# EasyEDA schematic Train_Barrierx7_OPTO.json
TITLE: Train Barrier controler x7 and opto; REV: o.0; Date: 2022-07-04; Sheet: 1/1; Drawn By: AmirB@mada.org.il; Company: Blomfield Science Museum
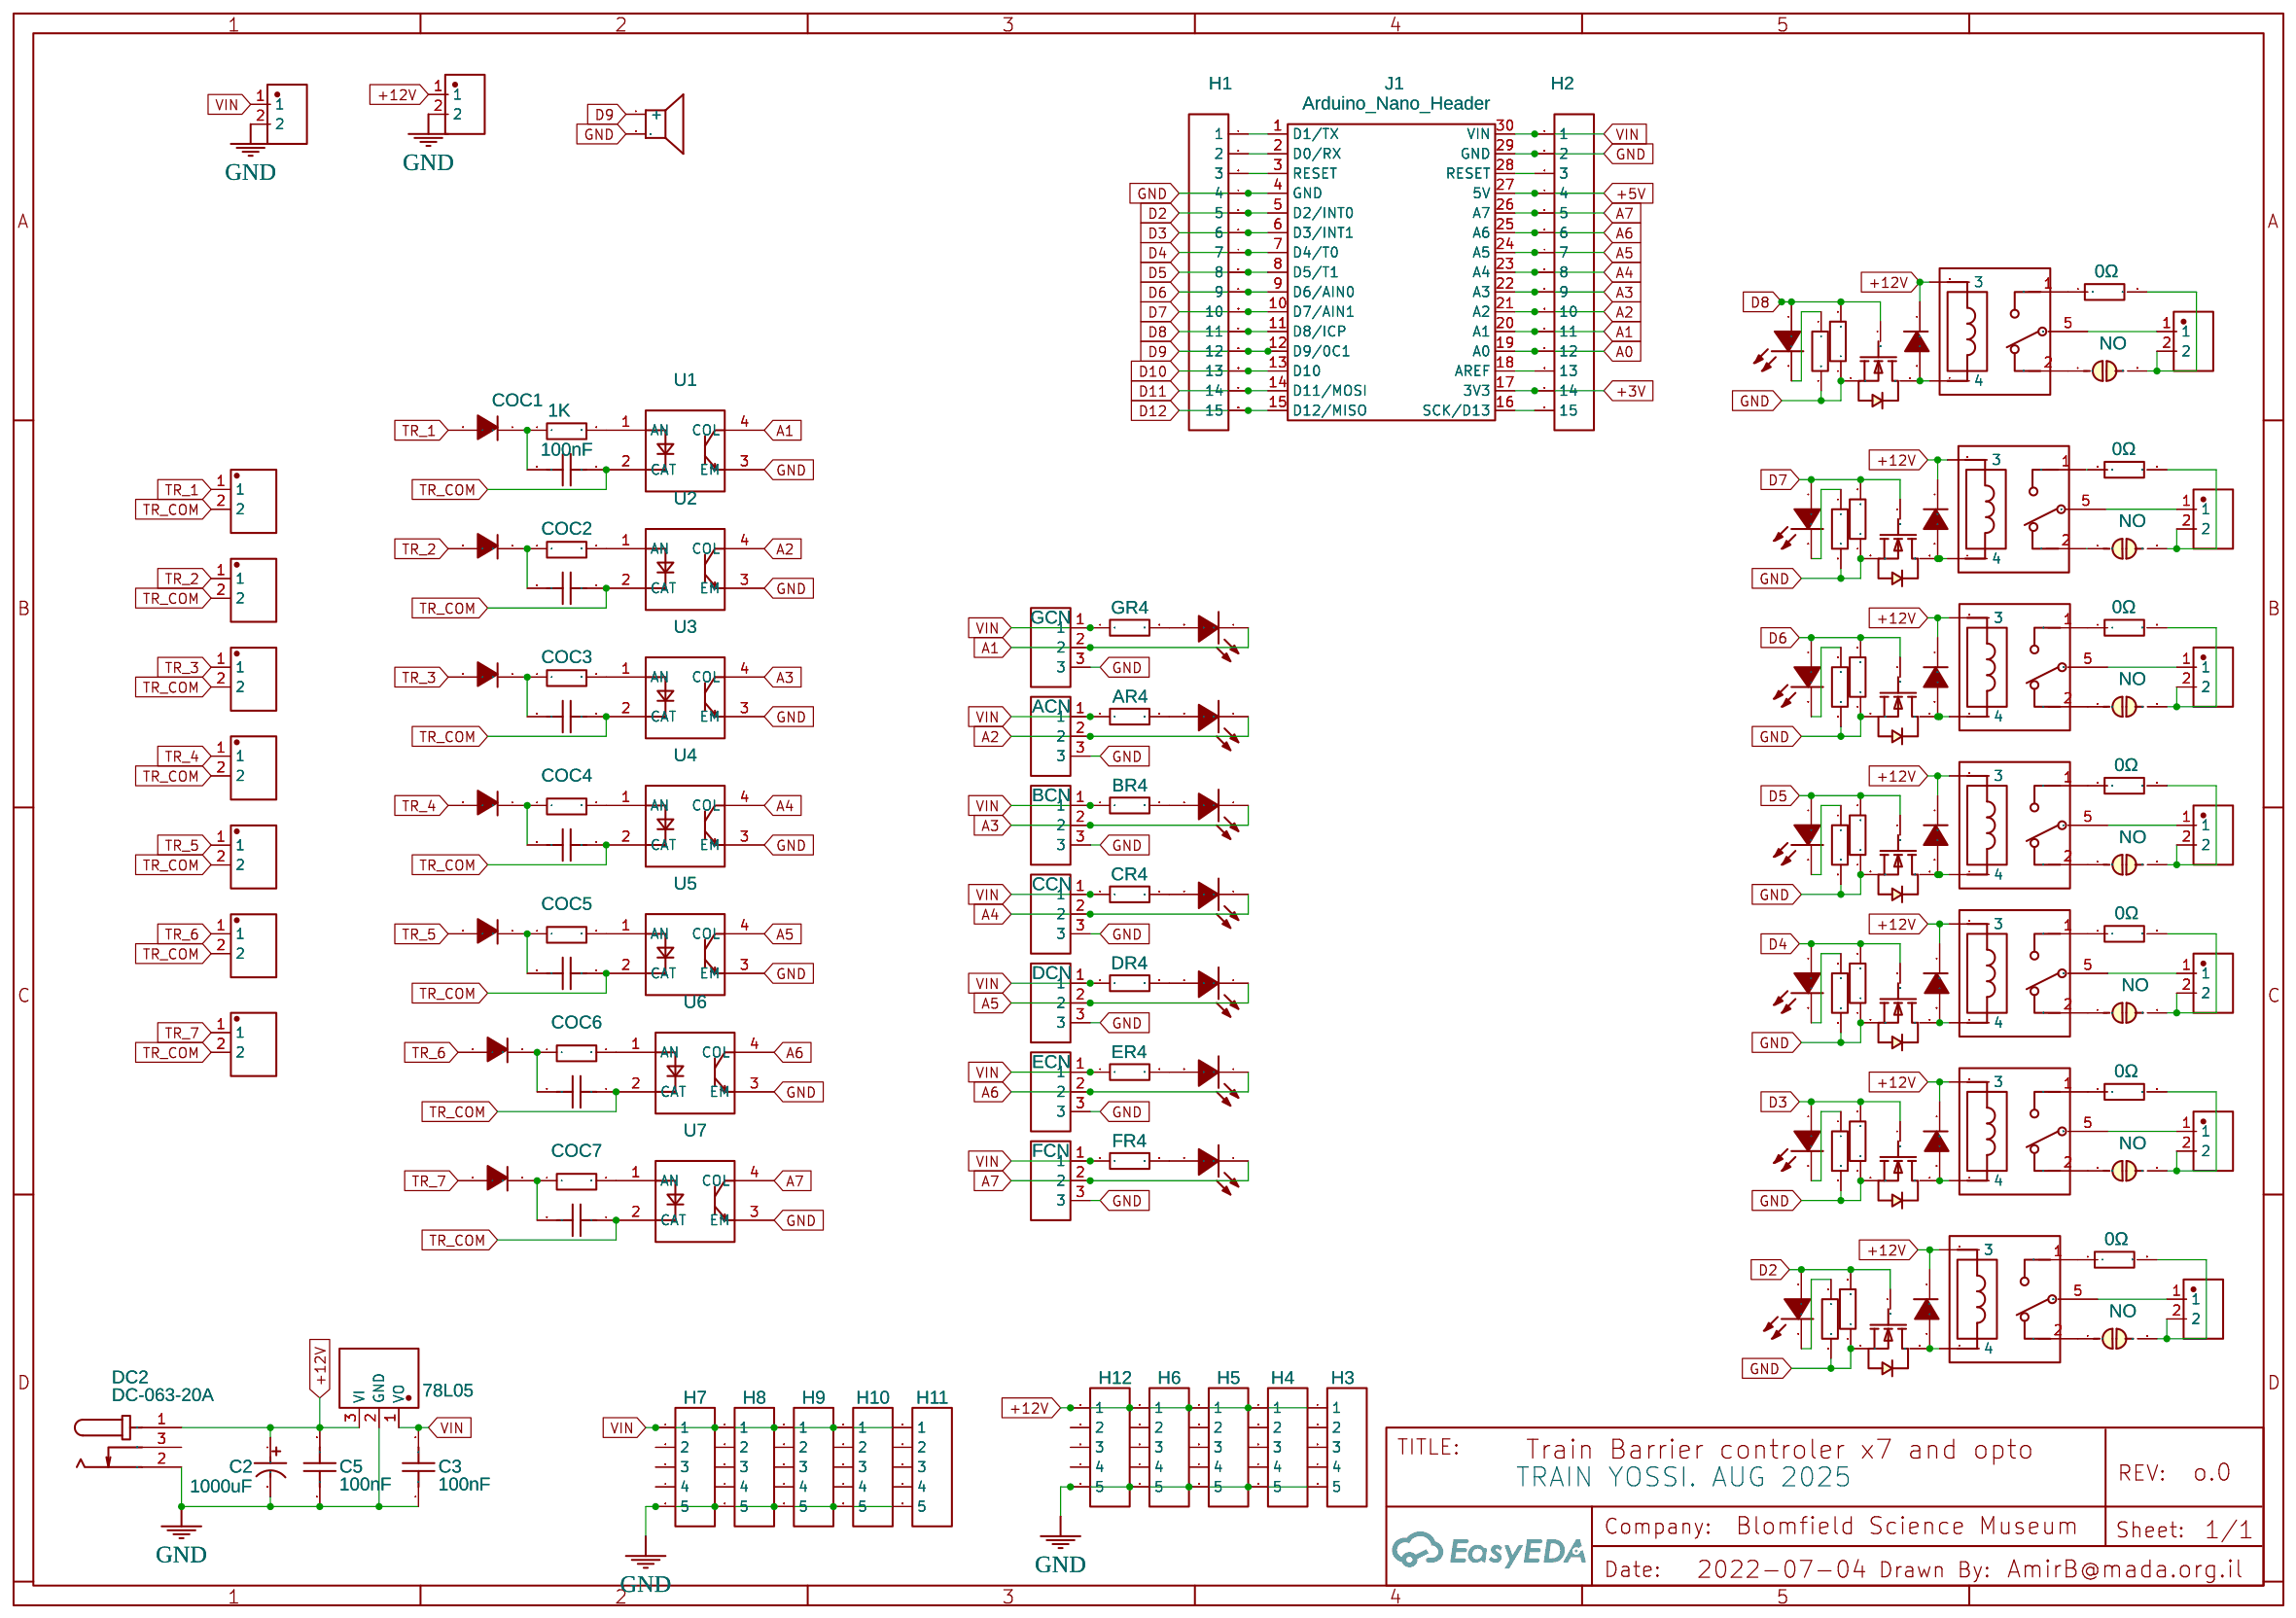
[diagram p0: schematic sheet]

## Parts
78L05  78L05_C842819  [SOT-89-3_L4.5-W2.5-P1.50-LS4.2-BR]
ACN  FK2510  [CONN-TH_3P-P2.00_KF2510_3A]
ACON1  KF2510-2A  [CONN-TH_KF2510-2A]
ACON2  KF2510-2A  [CONN-TH_KF2510-2A]
ACON3  KF2510-2A  [CONN-TH_KF2510-2A]
ACON4  KF2510-2A  [CONN-TH_KF2510-2A]
ACON5  KF2510-2A  [CONN-TH_KF2510-2A]
ACON6  KF2510-2A  [CONN-TH_KF2510-2A]
ACON7  KF2510-2A  [CONN-TH_KF2510-2A]
ACR  CR  [CONN-TH_P5.00_KF301-5.0-2P]
AD  SM4007PL  [SOD-123F_L2.8-W1.8-LS3.7-RD]
AJ  NO  [JUMPERS_SMT-JUMPER_2_NC_PASTE_NO-SILK]
AK  SRA-12VDC-CL  [RELAY-TH_SRA-X-CX]
AL  0603White light_C2290  [LED0603-R-RD_WHITE]
ALR  KT-0603R  [LED0603-RD]
AQ  AO3400A  [SOT-23-3_L2.9-W1.3-P1.90-LS2.4-BR]
AR1  1K  [R0603]
AR2  1K  [R0603]
AR3  0Ω  [R0402]
AR4  1kΩ  [R0603]
BCN  FK2510  [CONN-TH_3P-P2.00_KF2510_3A]
BCR  CR  [CONN-TH_P5.00_KF301-5.0-2P]
BD  SM4007PL  [SOD-123F_L2.8-W1.8-LS3.7-RD]
BJ  NO  [JUMPERS_SMT-JUMPER_2_NC_PASTE_NO-SILK]
BK  SRA-12VDC-CL  [RELAY-TH_SRA-X-CX]
BL  0603White light_C2290  [LED0603-R-RD_WHITE]
BLR  KT-0603R  [LED0603-RD]
BQ  AO3400A  [SOT-23-3_L2.9-W1.3-P1.90-LS2.4-BR]
BR1  1K  [R0603]
BR2  1K  [R0603]
BR3  0Ω  [R0402]
BR4  1kΩ  [R0603]
BUZZER1  BUZZER-12X9  [BUZ-TH_BD12.0-P7.60-D0.6-FD]
C2  1000uF  [CAP-TH_BD12.5-P5.00-D0.6-FD]
C3  100nF  [C0603]
C5  100nF  [C0603]
CCN  FK2510  [CONN-TH_3P-P2.00_KF2510_3A]
CCR  CR  [CONN-TH_P5.00_KF301-5.0-2P]
CD  SM4007PL  [SOD-123F_L2.8-W1.8-LS3.7-RD]
CJ  NO  [JUMPERS_SMT-JUMPER_2_NC_PASTE_NO-SILK]
CK  SRA-12VDC-CL  [RELAY-TH_SRA-X-CX]
CL  0603White light_C2290  [LED0603-R-RD_WHITE]
CLR  KT-0603R  [LED0603-RD]
COC1  100nF  [C0603]
COC2  100nF  [C0603]
COC3  100nF  [C0603]
COC4  100nF  [C0603]
COC5  100nF  [C0603]
COC6  100nF  [C0603]
COC7  100nF  [C0603]
CQ  AO3400A  [SOT-23-3_L2.9-W1.3-P1.90-LS2.4-BR]
CR1  1K  [R0603]
CR2  1K  [R0603]
CR3  0Ω  [R0402]
CR4  1kΩ  [R0603]
CR5V  CR5V  [CONN-TH_P5.00_KF301-5.0-2P]
CR12V  CR12V  [CONN-TH_P5.00_KF301-5.0-2P]
DC2  DC-063-20A  [DC-IN-TH_DC-063-20A]
DCN  FK2510  [CONN-TH_3P-P2.00_KF2510_3A]
DCR  CR  [CONN-TH_P5.00_KF301-5.0-2P]
DD  SM4007PL  [SOD-123F_L2.8-W1.8-LS3.7-RD]
DJ  NO  [JUMPERS_SMT-JUMPER_2_NC_PASTE_NO-SILK]
DK  SRA-12VDC-CL  [RELAY-TH_SRA-X-CX]
DL  0603White light_C2290  [LED0603-R-RD_WHITE]
DLR  KT-0603R  [LED0603-RD]
DOC1  SM4007PL  [SOD-123F_L2.8-W1.8-LS3.7-RD]
DOC2  SM4007PL  [SOD-123F_L2.8-W1.8-LS3.7-RD]
DOC3  SM4007PL  [SOD-123F_L2.8-W1.8-LS3.7-RD]
DOC4  SM4007PL  [SOD-123F_L2.8-W1.8-LS3.7-RD]
DOC5  SM4007PL  [SOD-123F_L2.8-W1.8-LS3.7-RD]
DOC6  SM4007PL  [SOD-123F_L2.8-W1.8-LS3.7-RD]
DOC7  SM4007PL  [SOD-123F_L2.8-W1.8-LS3.7-RD]
DQ  AO3400A  [SOT-23-3_L2.9-W1.3-P1.90-LS2.4-BR]
DR1  1K  [R0603]
DR2  1K  [R0603]
DR3  0Ω  [R0402]
DR4  1kΩ  [R0603]
ECN  FK2510  [CONN-TH_3P-P2.00_KF2510_3A]
ECR  CR  [CONN-TH_P5.00_KF301-5.0-2P]
ED  SM4007PL  [SOD-123F_L2.8-W1.8-LS3.7-RD]
EJ  NO  [JUMPERS_SMT-JUMPER_2_NC_PASTE_NO-SILK]
EK  SRA-12VDC-CL  [RELAY-TH_SRA-X-CX]
EL  0603White light_C2290  [LED0603-R-RD_WHITE]
ELR  KT-0603R  [LED0603-RD]
EQ  AO3400A  [SOT-23-3_L2.9-W1.3-P1.90-LS2.4-BR]
ER1  1K  [R0603]
ER2  1K  [R0603]
ER3  0Ω  [R0402]
ER4  1kΩ  [R0603]
FCN  FK2510  [CONN-TH_3P-P2.00_KF2510_3A]
FCR  CR  [CONN-TH_P5.00_KF301-5.0-2P]
FD  SM4007PL  [SOD-123F_L2.8-W1.8-LS3.7-RD]
FJ  NO  [JUMPERS_SMT-JUMPER_2_NC_PASTE_NO-SILK]
FK  SRA-12VDC-CL  [RELAY-TH_SRA-X-CX]
FL  0603White light_C2290  [LED0603-R-RD_WHITE]
FLR  KT-0603R  [LED0603-RD]
FQ  AO3400A  [SOT-23-3_L2.9-W1.3-P1.90-LS2.4-BR]
FR1  1K  [R0603]
FR2  1K  [R0603]
FR3  0Ω  [R0402]
FR4  1kΩ  [R0603]
GCN  FK2510  [CONN-TH_3P-P2.00_KF2510_3A]
GCR  CR  [CONN-TH_P5.00_KF301-5.0-2P]
GD  SM4007PL  [SOD-123F_L2.8-W1.8-LS3.7-RD]
GJ  NO  [JUMPERS_SMT-JUMPER_2_NC_PASTE_NO-SILK]
GK  SRA-12VDC-CL  [RELAY-TH_SRA-X-CX]
GL  0603White light_C2290  [LED0603-R-RD_WHITE]
GLR  KT-0603R  [LED0603-RD]
GQ  AO3400A  [SOT-23-3_L2.9-W1.3-P1.90-LS2.4-BR]
GR1  1K  [R0603]
GR2  1K  [R0603]
GR3  0Ω  [R0402]
GR4  1kΩ  [R0603]
H1  HDR-F-2.54_1x15  [HDR-F-2.54_1X15]
H2  HDR-F-2.54_1x15  [HDR-F-2.54_1X15]
H3  HDR-F-2.54_1x5  [HDR-F-2.54_1X5]
H4  HDR-F-2.54_1x5  [HDR-F-2.54_1X5]
H5  HDR-F-2.54_1x5  [HDR-F-2.54_1X5]
H6  HDR-F-2.54_1x5  [HDR-F-2.54_1X5]
H7  HDR-F-2.54_1x5  [HDR-F-2.54_1X5]
H8  HDR-F-2.54_1x5  [HDR-F-2.54_1X5]
H9  HDR-F-2.54_1x5  [HDR-F-2.54_1X5]
H10  HDR-F-2.54_1x5  [HDR-F-2.54_1X5]
H11  HDR-F-2.54_1x5  [HDR-F-2.54_1X5]
H12  HDR-F-2.54_1x5  [HDR-F-2.54_1X5]
J1  Arduino_Nano_Header  [DIP-30_L43.18-W15.24-ARDUINONANO]
ROC1  1K  [R0603]
ROC2  1K  [R0603]
ROC3  1K  [R0603]
ROC4  1K  [R0603]
ROC5  1K  [R0603]
ROC6  1K  [R0603]
ROC7  1K  [R0603]
U1  LTV-217-B-G  [SOP-4_L4.4-W2.8-P1.27-LS7.0-BR]
U2  LTV-217-B-G  [SOP-4_L4.4-W2.8-P1.27-LS7.0-BR]
U3  LTV-217-B-G  [SOP-4_L4.4-W2.8-P1.27-LS7.0-BR]
U4  LTV-217-B-G  [SOP-4_L4.4-W2.8-P1.27-LS7.0-BR]
U5  LTV-217-B-G  [SOP-4_L4.4-W2.8-P1.27-LS7.0-BR]
U6  LTV-217-B-G  [SOP-4_L4.4-W2.8-P1.27-LS7.0-BR]
U7  LTV-217-B-G  [SOP-4_L4.4-W2.8-P1.27-LS7.0-BR]

## Library data of the parts
78L05 = 78L05_C842819: Supplier: LCSC; Supplier Part: C842819; Manufacturer: FUXINSEMI; Contributor: LCSC; JLCPCB Part Class: Extended Part; Package Display: No
ACN BCN CCN DCN ECN FCN GCN = kf2510_3A: JLCPCB Part Class: Extended Part; Package Display: No
ACON1-ACON7 = KF2510-2A: Supplier: LCSC; Manufacturer: BOOMELE; Supplier Part: C27543; JLCPCB Part Class: Extended Part; Package Display: No
ACR BCR CCR CR5V CR12V DCR ECR FCR GCR = KF301-5.0-2P: Supplier: LCSC; Supplier Part: C474881; Manufacturer: Cixi Kefa Elec; Contributor: LCSC; JLCPCB Part Class: Extended Part; Package Display: No
AD BD CD DD DOC1-DOC7 ED FD GD = SM4007PL: Supplier: LCSC; Manufacturer: MDD(辰达半导体); Supplier Part: C64898; JLCPCB Part Class: Basic Part; Package Display: No
AJ BJ CJ DJ EJ FJ GJ = JUMPER-SMT_2: Contributor: P-Thomsen; Package Display: No
AK BK CK DK EK FK GK = SRA-12VDC-CL: Supplier: LCSC; Manufacturer: 松乐; Supplier Part: C60169; JLCPCB Part Class: Extended Part; Package Display: No
AL BL CL DL EL FL GL = 0603White light_C2290: Supplier: LCSC; Manufacturer: KENTO; Supplier Part: C2290; JLCPCB Part Class: Basic Part; Package Display: No
ALR BLR CLR DLR ELR FLR GLR = KT-0603R: Supplier: LCSC; Manufacturer: KENTO; Supplier Part: C2286; JLCPCB Part Class: Basic Part; Package Display: No
AQ BQ CQ DQ EQ FQ GQ = AO3400A: Supplier: LCSC; Manufacturer: AOS; Supplier Part: C20917; JLCPCB Part Class: Basic Part; Package Display: No
AR1 AR2 BR1 BR2 CR1 CR2 DR1 DR2 ER1 ER2 FR1 FR2 GR1 GR2 ROC1-ROC7 = 0603WAF1001T5E: Supplier: LCSC; Manufacturer: UniOhm; Supplier Part: C21190; JLCPCB Part Class: Basic Part; Package Display: No
AR3 BR3 CR3 DR3 ER3 FR3 GR3 = 0402WGF0000TCE: Supplier: LCSC; Manufacturer: UniOhm; Supplier Part: C17168; Resistance (Ohms): 0; JLCPCB Part Class: Basic Part; Package Display: No
AR4 BR4 CR4 DR4 ER4 FR4 GR4 = 0603WAF1001T5E: Supplier: LCSC; Manufacturer: UniOhm; Supplier Part: C21190; Resistance (Ohms): 1K; JLCPCB Part Class: Basic Part; Package Display: No
BUZZER1 = BUZZER-12X9: Contributor: lcsc; Supplier: LCSC; Supplier Part: C9900016920; Manufacturer: null; JLCPCB Part Class: Extended Part; Package Display: No
C2 = 1000uF 50V: Supplier: LCSC; Manufacturer: ValuePro; Supplier Part: C18104; JLCPCB Part Class: Extended Part; Package Display: No
C3 C5 COC1-COC7 = CC0603KRX7R9BB104: Supplier: LCSC; Manufacturer: YAGEO; Supplier Part: C14663; JLCPCB Part Class: Basic Part; Package Display: No
DC2 = DC-063-20A: Supplier: LCSC; Supplier Part: C707268; Manufacturer: 韩国韩荣; Contributor: LCSC; JLCPCB Part Class: Extended Part; Package Display: No
H1 H2 = HDR-F-2.54_1x15: Supplier Part: C124408; Supplier: LCSC; Contributor: LCEDA_Lib; Package Display: No
H3-H12 = HDR-F-2.54_1x5: Supplier Part: C50950; Supplier: LCSC; Contributor: LCEDA_Lib; Package Display: No
J1 = Arduino_Nano_Header
U1-U7 = LTV-217-B-G: Contributor: LCSC; Supplier: LCSC; Manufacturer: LITEON(光宝); Supplier Part: C115450; JLCPCB Part Class: Basic Part; Package Display: No

## Nets
+3V: H2.14 J1.17(3V3)
+5V: H2.4 J1.27(5V)
+12V: 78L05.3(VI) AD.1(C) AK.3 BD.1(C) BK.3 C2.1 C5.2 CD.1(C) CK.3 CR12V.1 DC2.1 DD.1(C) DK.3 ED.1(C) EK.3 FD.1(C) FK.3 GD.1(C) GK.3 H3.1 H4.1 H5.1 H6.1 H12.1
GND: 78L05.2(GND) ACN.3 AQ.2(S) AR1.1 AR2.2 BCN.3 BQ.2(S) BR1.1 BR2.2 BUZZER1.2 C2.2 C3.1 C5.1 CCN.3 CQ.2(S) CR1.1 CR2.2 CR5V.2 CR12V.2 DC2.2 DCN.3 DQ.2(S) DR1.1 DR2.2 ECN.3 EQ.2(S) ER1.1 ER2.2 FCN.3 FQ.2(S) FR1.1 FR2.2 GCN.3 GQ.2(S) GR1.1 GR2.2 H1.4 H2.2 H3.5 H4.5 H5.5 H6.5 H7.5 H8.5 H9.5 H10.5 H11.5 H12.5 J1.4(GND) J1.29(GND) U1.3(EM) U2.3(EM) U3.3(EM) U4.3(EM) U5.3(EM) U6.3(EM) U7.3(EM)
VIN: 78L05.1(VO) ACN.1 AR4.1 BCN.1 BR4.1 C3.2 CCN.1 CR4.1 CR5V.1 DCN.1 DR4.1 ECN.1 ER4.1 FCN.1 FR4.1 GCN.1 GR4.1 H2.1 H7.1 H8.1 H9.1 H10.1 H11.1 J1.30(VIN)
A0: H2.12 J1.19(A0)
A1: GCN.2 GLR.1(K) H2.11 J1.20(A1) U1.4(COL)
A2: ACN.2 ALR.1(K) H2.10 J1.21(A2) U2.4(COL)
A3: BCN.2 BLR.1(K) H2.9 J1.22(A3) U3.4(COL)
A4: CCN.2 CLR.1(K) H2.8 J1.23(A4) U4.4(COL)
A5: DCN.2 DLR.1(K) H2.7 J1.24(A5) U5.4(COL)
A6: ECN.2 ELR.1(K) H2.6 J1.25(A6) U6.4(COL)
A7: FCN.2 FLR.1(K) H2.5 J1.26(A7) U7.4(COL)
D2: FL.1(A) FQ.1(G) FR1.2 H1.5 J1.5(D2/INT0)
D3: EL.1(A) EQ.1(G) ER1.2 H1.6 J1.6(D3/INT1)
D4: DL.1(A) DQ.1(G) DR1.2 H1.7 J1.7(D4/T0)
D5: CL.1(A) CQ.1(G) CR1.2 H1.8 J1.8(D5/T1)
D6: BL.1(A) BQ.1(G) BR1.2 H1.9 J1.9(D6/AIN0)
D7: AL.1(A) AQ.1(G) AR1.2 H1.10 J1.10(D7/AIN1)
D8: GL.1(A) GQ.1(G) GR1.2 H1.11 J1.11(D8/ICP)
D9: BUZZER1.1(+) H1.12 J1.12(D9/0C1)
D10: H1.13 J1.13(D10)
D11: H1.14 J1.14(D11/MOSI)
D12: H1.15 J1.15(D12/MISO)
TR_1: ACON1.1 DOC1.2(A)
TR_2: ACON2.1 DOC2.2(A)
TR_3: ACON3.1 DOC3.2(A)
TR_4: ACON4.1 DOC4.2(A)
TR_5: ACON5.1 DOC5.2(A)
TR_6: ACON6.1 DOC6.2(A)
TR_7: ACON7.1 DOC7.2(A)
TR_COM: ACON1.2 ACON2.2 ACON3.2 ACON4.2 ACON5.2 ACON6.2 ACON7.2 COC1.1 COC2.1 COC3.1 COC4.1 COC5.1 COC6.1 COC7.1 U1.2(CAT) U2.2(CAT) U3.2(CAT) U4.2(CAT) U5.2(CAT) U6.2(CAT) U7.2(CAT)
Net-(ACR-1): ACR.1 AK.5
Net-(ACR-2): ACR.2 AJ.2 AR3.2
Net-(AD-2): AD.2(A) AK.4 AQ.3(D)
Net-(AJ-1): AJ.1 AK.2
Net-(AK-1): AK.1 AR3.1
Net-(AL-2): AL.2(K) AR2.1
Net-(ALR-2): ALR.2(A) AR4.2
Net-(BCR-1): BCR.1 BK.5
Net-(BCR-2): BCR.2 BJ.2 BR3.2
Net-(BD-2): BD.2(A) BK.4 BQ.3(D)
Net-(BJ-1): BJ.1 BK.2
Net-(BK-1): BK.1 BR3.1
Net-(BL-2): BL.2(K) BR2.1
Net-(BLR-2): BLR.2(A) BR4.2
Net-(CCR-1): CCR.1 CK.5
Net-(CCR-2): CCR.2 CJ.2 CR3.2
Net-(CD-2): CD.2(A) CK.4 CQ.3(D)
Net-(CJ-1): CJ.1 CK.2
Net-(CK-1): CK.1 CR3.1
Net-(CL-2): CL.2(K) CR2.1
Net-(CLR-2): CLR.2(A) CR4.2
Net-(COC1-2): COC1.2 DOC1.1(C) ROC1.1
Net-(COC2-2): COC2.2 DOC2.1(C) ROC2.1
Net-(COC3-2): COC3.2 DOC3.1(C) ROC3.1
Net-(COC4-2): COC4.2 DOC4.1(C) ROC4.1
Net-(COC5-2): COC5.2 DOC5.1(C) ROC5.1
Net-(COC6-2): COC6.2 DOC6.1(C) ROC6.1
Net-(COC7-2): COC7.2 DOC7.1(C) ROC7.1
Net-(DCR-1): DCR.1 DK.5
Net-(DCR-2): DCR.2 DJ.2 DR3.2
Net-(DD-2): DD.2(A) DK.4 DQ.3(D)
Net-(DJ-1): DJ.1 DK.2
Net-(DK-1): DK.1 DR3.1
Net-(DL-2): DL.2(K) DR2.1
Net-(DLR-2): DLR.2(A) DR4.2
Net-(ECR-1): ECR.1 EK.5
Net-(ECR-2): ECR.2 EJ.2 ER3.2
Net-(ED-2): ED.2(A) EK.4 EQ.3(D)
Net-(EJ-1): EJ.1 EK.2
Net-(EK-1): EK.1 ER3.1
Net-(EL-2): EL.2(K) ER2.1
Net-(ELR-2): ELR.2(A) ER4.2
Net-(FCR-1): FCR.1 FK.5
Net-(FCR-2): FCR.2 FJ.2 FR3.2
Net-(FD-2): FD.2(A) FK.4 FQ.3(D)
Net-(FJ-1): FJ.1 FK.2
Net-(FK-1): FK.1 FR3.1
Net-(FL-2): FL.2(K) FR2.1
Net-(FLR-2): FLR.2(A) FR4.2
Net-(GCR-1): GCR.1 GK.5
Net-(GCR-2): GCR.2 GJ.2 GR3.2
Net-(GD-2): GD.2(A) GK.4 GQ.3(D)
Net-(GJ-1): GJ.1 GK.2
Net-(GK-1): GK.1 GR3.1
Net-(GL-2): GL.2(K) GR2.1
Net-(GLR-2): GLR.2(A) GR4.2
Net-(H1-1): H1.1 J1.1(D1/TX)
Net-(H1-2): H1.2 J1.2(D0/RX)
Net-(H1-3): H1.3 J1.3(RESET)
Net-(H2-3): H2.3 J1.28(RESET)
Net-(H2-13): H2.13 J1.18(AREF)
Net-(H2-15): H2.15 J1.16(SCK/D13)
Net-(ROC1-2): ROC1.2 U1.1(AN)
Net-(ROC2-2): ROC2.2 U2.1(AN)
Net-(ROC3-2): ROC3.2 U3.1(AN)
Net-(ROC4-2): ROC4.2 U4.1(AN)
Net-(ROC5-2): ROC5.2 U5.1(AN)
Net-(ROC6-2): ROC6.2 U6.1(AN)
Net-(ROC7-2): ROC7.2 U7.1(AN)

Not connected (* = marked no-connect by the designer): DC2 3; H3 2 3 4; H4 2 3 4; H5 2 3 4; H6 2 3 4; H7 2 3 4; H8 2 3 4; H9 2 3 4; H10 2 3 4; H11 2 3 4; H12 2 3 4

## Notes on the sheet
- TRAIN YOSSI. AUG 2025
